# Altium schematic sheet ControleurInterface.SchDoc: Connecteur B2B
size Letter; ApprovedBy: Kevin Cotton; Author: Jessica Di Stefano; Revision: A; SheetNumber: 5; SheetTotal: 7
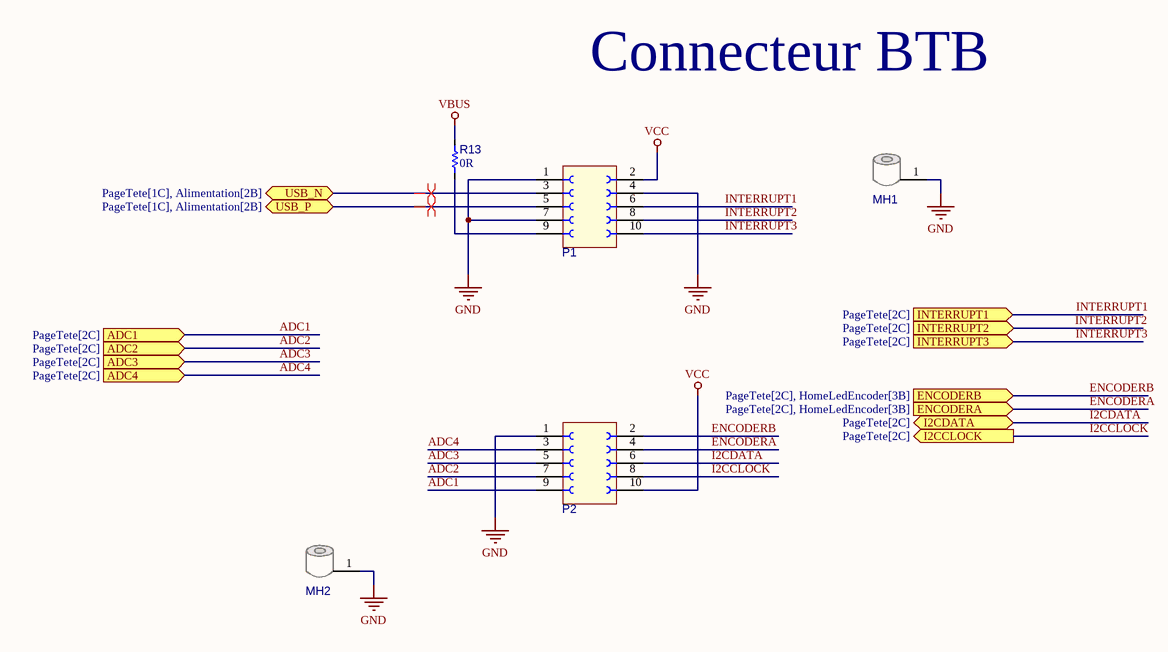
[diagram p0: ControleurInterface.SchDoc]

## Parts
MH1  SMTSO1430MTJ  [MP_Standoff_M1.4x3mm_SMT]  (value not drawn)
MH2  SMTSO1430MTJ  [MP_Standoff_M1.4x3mm_SMT]  (value not drawn)
P1  HC-PBB12NB(3.0)-10DP-0.5V-03  [P_CONN_HDR_2ROW_10POS_0MM5]  (value not drawn)
P2  HC-PBB12NB(3.0)-10DP-0.5V-03  [P_CONN_HDR_2ROW_10POS_0MM5]  (value not drawn)
R13  value 0R  [R_1005[0402]]  (hidden comment: Res 0R 0402)

## Ports
ADC1 (in, see PageTete[2C]), ADC2 (in, see PageTete[2C]), ADC3 (in, see PageTete[2C]), ADC4 (in, see PageTete[2C]), ENCODERA (in, see PageTete[2C], HomeLedEncoder[3B]), ENCODERB (in, see PageTete[2C], HomeLedEncoder[3B]), I2CCLOCK (out, see PageTete[2C]), I2CDATA (bidir, see PageTete[2C]), INTERRUPT1 (in, see PageTete[2C]), INTERRUPT2 (in, see PageTete[2C]), INTERRUPT3 (in, see PageTete[2C]), USB_N (bidir, see PageTete[1C], Alimentation[2B]), USB_P (bidir, see PageTete[1C], Alimentation[2B])

## Nets
GND: MH1.1 MH2.1 P1.1 P1.4 P1.7 P2.1
VBUS: R13.2
VCC: P1.2 P2.10
ADC1: P2.9 ; port ADC1
ADC2: P2.7 ; port ADC2
ADC3: P2.5 ; port ADC3
ADC4: P2.3 ; port ADC4
ENCODERA: P2.4 ; port ENCODERA
ENCODERB: P2.2 ; port ENCODERB
I2CCLOCK: P2.8 ; port I2CCLOCK
I2CDATA: P2.6 ; port I2CDATA
INTERRUPT1: P1.6 ; port INTERRUPT1
INTERRUPT2: P1.8 ; port INTERRUPT2
INTERRUPT3: P1.10 ; port INTERRUPT3
USB_N: P1.3 ; port USB_N
USB_P: P1.5 ; port USB_P
NetP1_9: P1.9 R13.1

## Layout directives
differential pair: USB_N, USB_P

## Notes on the sheet
- Connecteur BTB
- Titre :
- Conception :
- Date :
- Approbation :
- Heure :
- Révision :
- Feuille
- de
- Fichier :

## Library data of the parts
MH1 MH2 = MP_1.4MM_3MM_SMD: Mounting Standoff Threaded 1.4mm, stack height 3mm, SMD; Manufacturer 1: Sinhoo; Manufacturer Part Number 1: SMTSO1430MTJ; Mounting Technology: SMT; Supplier 1: LCSC; Supplier Part Number 1: C2915624
P1 P2 = Conn_02x05_Header: Connector Header 2x5pos, 0,5mm; Manufacturer 1: HCTL; Manufacturer 2: Hirose; Manufacturer Part Number 1: HC-PBB12NB(3.0)-10DP-0.5V-03; Manufacturer Part Number 2: DF12NB(3.0)-10DP-0.5V(51); Mounting Technology: SMT; Value: Conn_02x05; Supplier 1: LCSC; Supplier 2: Digikey; Supplier Part Number 1: C22359413; Supplier Part Number 2: 26-DF12NB(3.0)-10DP-0.5V(51)CT-ND
R13 = RES005: Resistor type 1; Manufacturer 1: Yageo; Manufacturer Part Number 1: RC0402JR-070RL; Max Working Voltage: 50V; LibRef: RES005; Mounting Technology: SMT; Supplier 1: LCSC; Supplier Part Number 1: C60485